# Altium schematic sheet RFMC_ADC.SchDoc: RFSoC AMC
size 420 x 297 mm; CompanyName: WUT; DrawnBy: T. Przywozki; Organization: WUT ISE; Address1: Warsaw University of Technology; Address2: Nowowiejska 15/19 00-665 Warsaw; Address3: Tomasz.Przywozki@pw.edu.pl; DocumentNumber: 18; Revision: 1; SheetNumber: 18; SheetTotal: 45; Project: RFSoC AMC; ModifiedBy: T. Przywozki; CreateDate: -; CheckedDate: -; DivGrp: ISE; Designer: T. Przywozki; ModifiedDate: -; ProjectName: ADC/DAC MEZZANINE
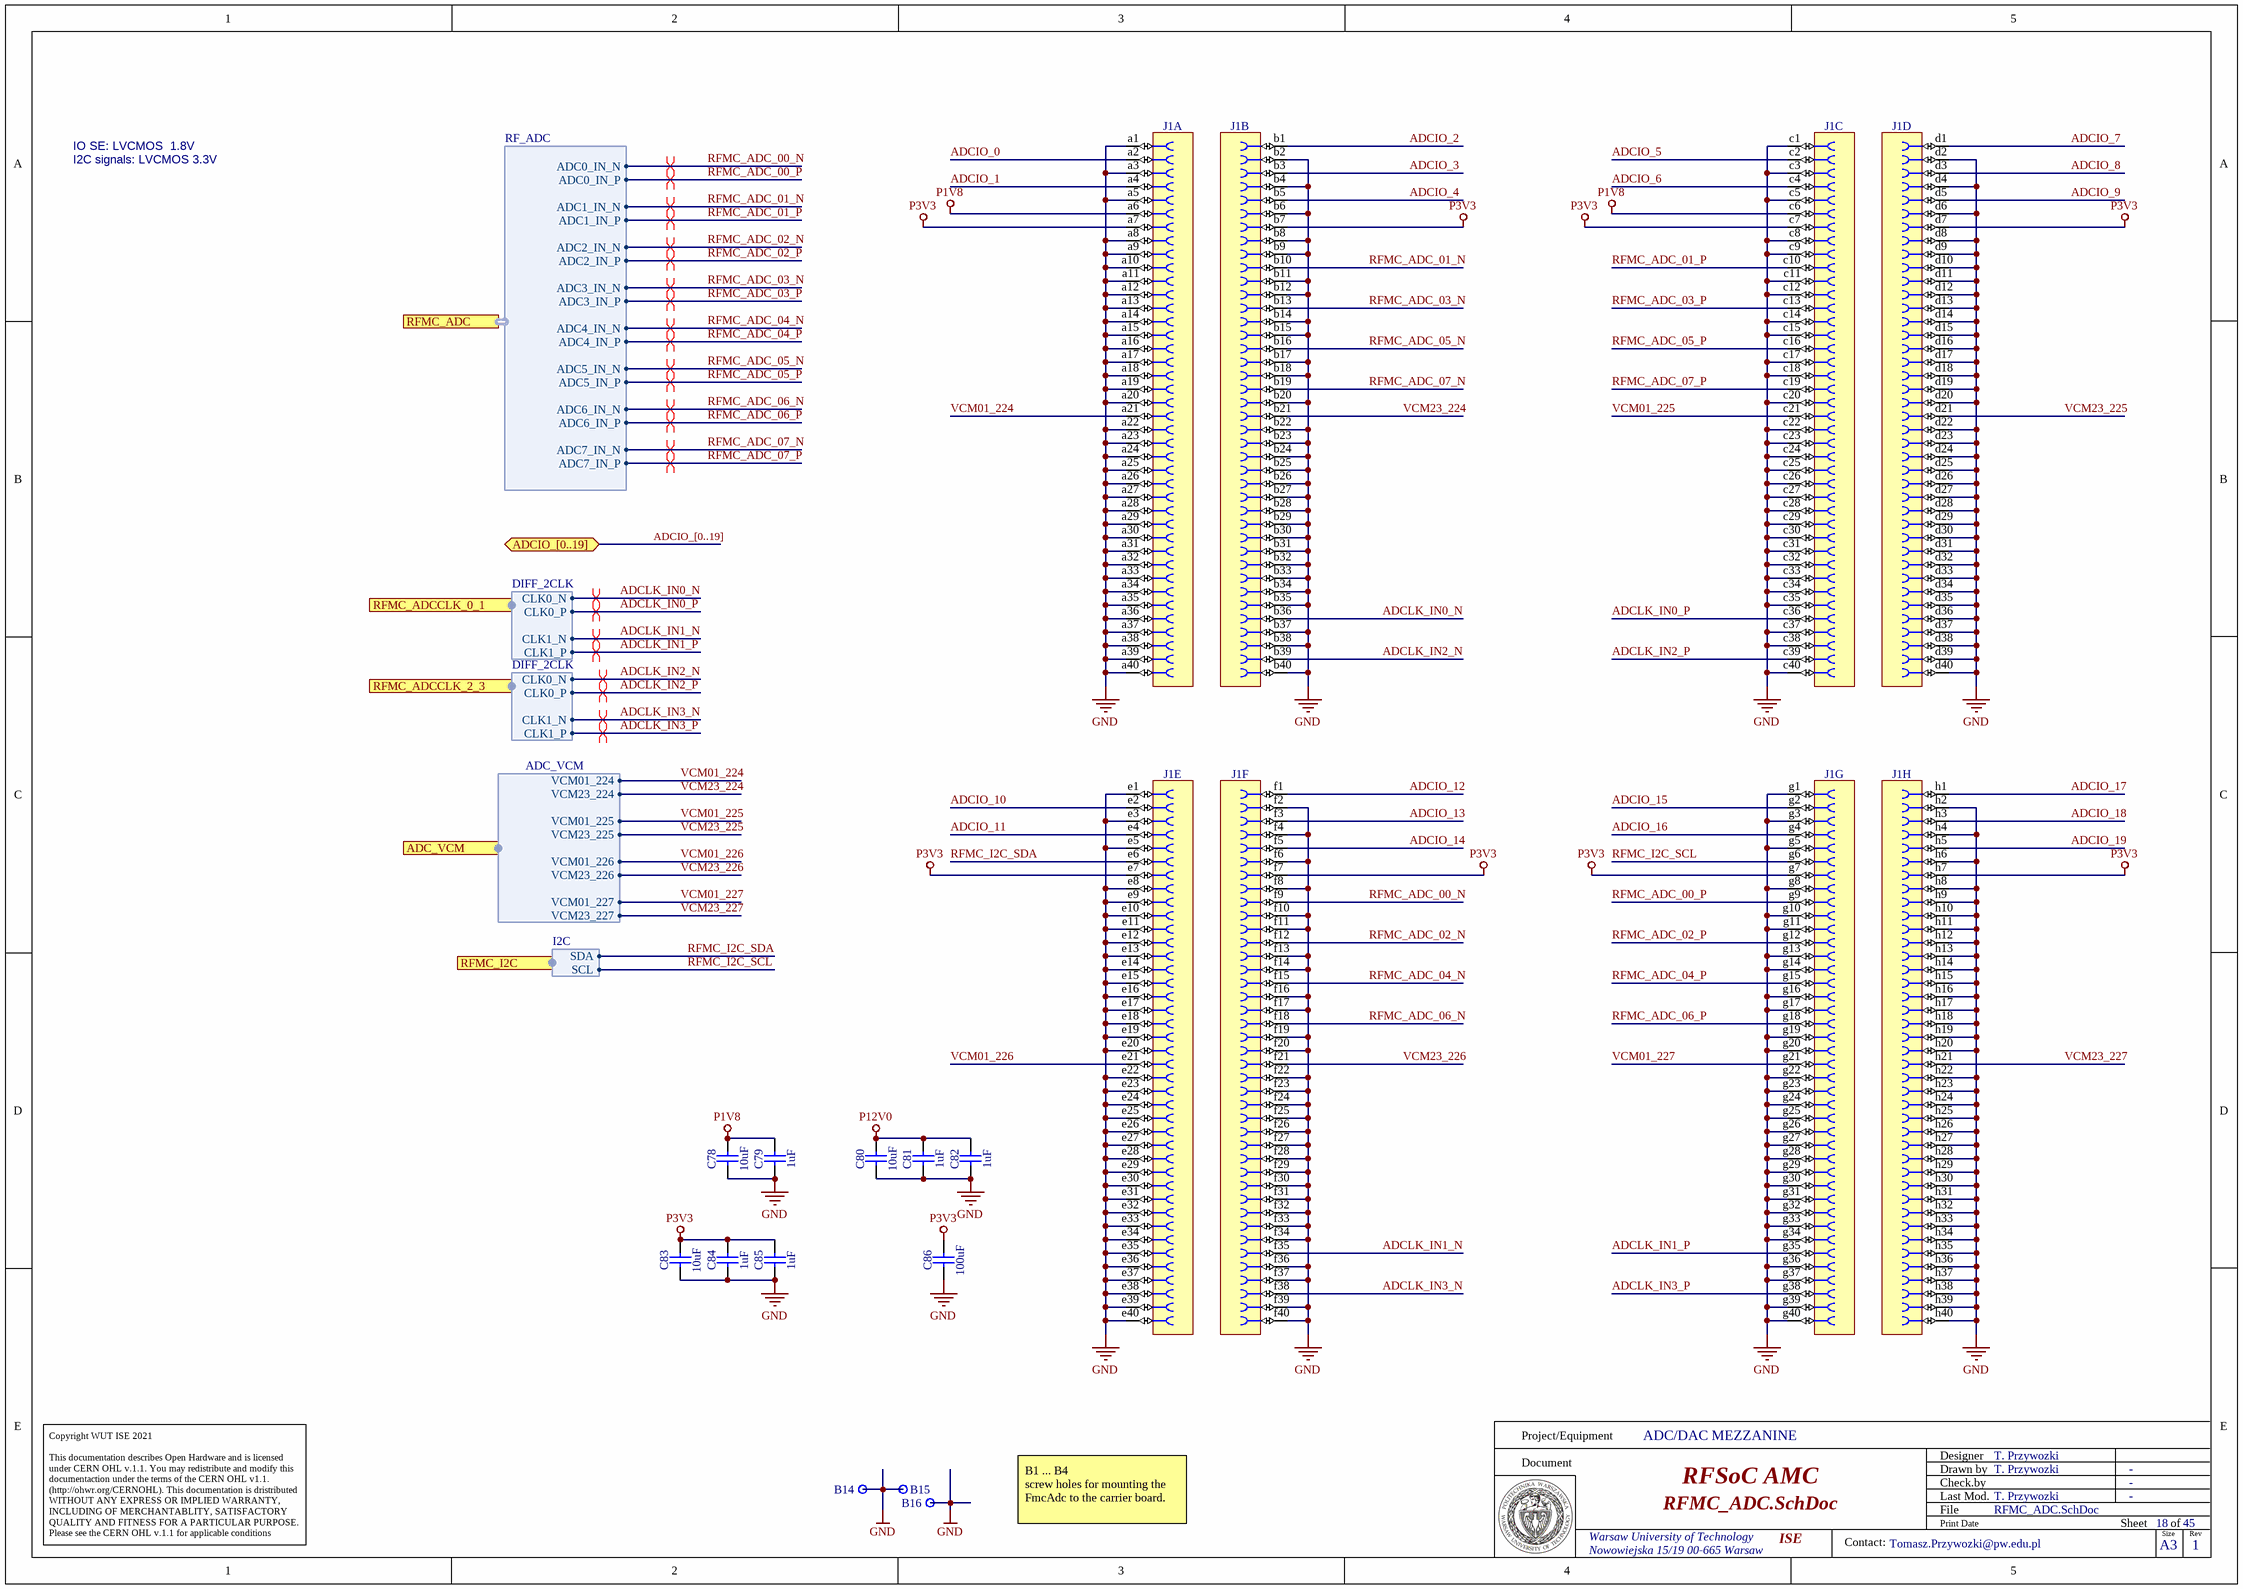
[diagram p0: RFMC_ADC.SchDoc]

## Parts
B14  Plated Hole  [MTG270_500]  (value not drawn)
B15  Plated Hole  [MTG270_500]  (value not drawn)
B16  Plated Hole  [MTG270_500]  (value not drawn)
C78  10uF  [CAPC1608X80N]
C79  1uF  [CAPC1005X55N]
C80  10uF  [CAPC1608X80N]
C81  1uF  [CAPC1005X55N]
C82  1uF  [CAPC1005X55N]
C83  10uF  [CAPC1608X80N]
C84  1uF  [CAPC1005X55N]
C85  1uF  [CAPC1005X55N]
C86  100uF  [CAPC3216X180N]
J1  (no value)  [SAMTEC_LPAF-40-03.0-S-08]  (parts A,B,C,D,E,F,G,H of 8)

## Ports
ADC_VCM (harness ADC_VCM), ADCIO_[0..19] (bidir), RFMC_ADC (harness RF_ADC), RFMC_ADCCLK_0_1 (harness DIFF_2CLK), RFMC_ADCCLK_2_3 (harness DIFF_2CLK), RFMC_I2C (harness I2C)

## Harnesses
RF_ADC: ADC0_IN_N, ADC0_IN_P, ADC1_IN_N, ADC1_IN_P, ADC2_IN_N, ADC2_IN_P, ADC3_IN_N, ADC3_IN_P, ADC4_IN_N, ADC4_IN_P, ADC5_IN_N, ADC5_IN_P, ADC6_IN_N, ADC6_IN_P, ADC7_IN_N, ADC7_IN_P
ADC_VCM: VCM01_224, VCM23_224, VCM23_225, VCM01_226, VCM01_227, VCM23_227, VCM01_225, VCM23_226
DIFF_2CLK: CLK0_P, CLK0_N, CLK1_P, CLK1_N
I2C: SCL, SDA

## Nets
GND: B14.1 B15.1 B16.1 C78.1 C79.2 C80.1 C81.2 C82.2 C83.1 C84.2 C85.2 C86.1 J1.a1 J1.a3 J1.a5 J1.a8 J1.a9 J1.a10 J1.a11 J1.a12 J1.a13 J1.a14 J1.a15 J1.a16 J1.a17 J1.a18 J1.a19 J1.a20 J1.a22 J1.a23 J1.a24 J1.a25 J1.a26 J1.a27 J1.a28 J1.a29 J1.a30 J1.a31 J1.a32 J1.a33 J1.a34 J1.a35 J1.a36 J1.a37 J1.a38 J1.a39 J1.a40 J1.b2 J1.b4 J1.b6 J1.b8 J1.b9 J1.b11 J1.b12 J1.b14 J1.b15 J1.b17 J1.b18 J1.b20 J1.b22 J1.b23 J1.b24 J1.b25 J1.b26 J1.b27 J1.b28 J1.b29 J1.b30 J1.b31 J1.b32 J1.b33 J1.b34 J1.b35 J1.b37 J1.b38 J1.b40 J1.c1 J1.c3 J1.c5 J1.c8 J1.c9 J1.c11 J1.c12 J1.c14 J1.c15 J1.c17 J1.c18 J1.c20 J1.c22 J1.c23 J1.c24 J1.c25 J1.c26 J1.c27 J1.c28 J1.c29 J1.c30 J1.c31 J1.c32 J1.c33 J1.c34 J1.c35 J1.c37 J1.c38 J1.c40 J1.d2 J1.d4 J1.d6 J1.d8 J1.d9 J1.d10 J1.d11 J1.d12 J1.d13 J1.d14 J1.d15 J1.d16 J1.d17 J1.d18 J1.d19 J1.d20 J1.d22 J1.d23 J1.d24 J1.d25 J1.d26 J1.d27 J1.d28 J1.d29 J1.d30 J1.d31 J1.d32 J1.d33 J1.d34 J1.d35 J1.d36 J1.d37 J1.d38 J1.d39 J1.d40 J1.e1 J1.e3 J1.e5 J1.e8 J1.e9 J1.e10 J1.e11 J1.e12 J1.e13 J1.e14 J1.e15 J1.e16 J1.e17 J1.e18 J1.e19 J1.e20 J1.e22 J1.e23 J1.e24 J1.e25 J1.e26 J1.e27 J1.e28 J1.e29 J1.e30 J1.e31 J1.e32 J1.e33 J1.e34 J1.e35 J1.e36 J1.e37 J1.e38 J1.e39 J1.e40 J1.f2 J1.f4 J1.f6 J1.f8 J1.f10 J1.f11 J1.f13 J1.f14 J1.f16 J1.f17 J1.f19 J1.f20 J1.f22 J1.f23 J1.f24 J1.f25 J1.f26 J1.f27 J1.f28 J1.f29 J1.f30 J1.f31 J1.f32 J1.f33 J1.f34 J1.f36 J1.f37 J1.f39 J1.f40 J1.g1 J1.g3 J1.g5 J1.g8 J1.g10 J1.g11 J1.g13 J1.g14 J1.g16 J1.g17 J1.g19 J1.g20 J1.g22 J1.g23 J1.g24 J1.g25 J1.g26 J1.g27 J1.g28 J1.g29 J1.g30 J1.g31 J1.g32 J1.g33 J1.g34 J1.g36 J1.g37 J1.g39 J1.g40 J1.h2 J1.h4 J1.h6 J1.h8 J1.h9 J1.h10 J1.h11 J1.h12 J1.h13 J1.h14 J1.h15 J1.h16 J1.h17 J1.h18 J1.h19 J1.h20 J1.h22 J1.h23 J1.h24 J1.h25 J1.h26 J1.h27 J1.h28 J1.h29 J1.h30 J1.h31 J1.h32 J1.h33 J1.h34 J1.h35 J1.h36 J1.h37 J1.h38 J1.h39 J1.h40
P1V8: C78.2 C79.1 J1.a6 J1.c6
P3V3: C83.2 C84.1 C85.1 C86.2 J1.a7 J1.b7 J1.c7 J1.d7 J1.e7 J1.f7 J1.g7 J1.h7
P12V0: C80.2 C81.1 C82.1
ADCIO_0: J1.a2
ADCIO_1: J1.a4
ADCIO_2: J1.b1
ADCIO_3: J1.b3
ADCIO_4: J1.b5
ADCIO_5: J1.c2
ADCIO_6: J1.c4
ADCIO_7: J1.d1
ADCIO_8: J1.d3
ADCIO_9: J1.d5
ADCIO_10: J1.e2
ADCIO_11: J1.e4
ADCIO_12: J1.f1
ADCIO_13: J1.f3
ADCIO_14: J1.f5
ADCIO_15: J1.g2
ADCIO_16: J1.g4
ADCIO_17: J1.h1
ADCIO_18: J1.h3
ADCIO_19: J1.h5
ADCLK_IN0_N: J1.b36 ; port RFMC_ADCCLK_0_1.CLK0_N
ADCLK_IN0_P: J1.c36 ; port RFMC_ADCCLK_0_1.CLK0_P
ADCLK_IN1_N: J1.f35 ; port RFMC_ADCCLK_0_1.CLK1_N
ADCLK_IN1_P: J1.g35 ; port RFMC_ADCCLK_0_1.CLK1_P
ADCLK_IN2_N: J1.b39 ; port RFMC_ADCCLK_2_3.CLK0_N
ADCLK_IN2_P: J1.c39 ; port RFMC_ADCCLK_2_3.CLK0_P
ADCLK_IN3_N: J1.f38 ; port RFMC_ADCCLK_2_3.CLK1_N
ADCLK_IN3_P: J1.g38 ; port RFMC_ADCCLK_2_3.CLK1_P
RFMC_ADC_00_N: J1.f9 ; port RFMC_ADC.ADC0_IN_N
RFMC_ADC_00_P: J1.g9 ; port RFMC_ADC.ADC0_IN_P
RFMC_ADC_01_N: J1.b10 ; port RFMC_ADC.ADC1_IN_N
RFMC_ADC_01_P: J1.c10 ; port RFMC_ADC.ADC1_IN_P
RFMC_ADC_02_N: J1.f12 ; port RFMC_ADC.ADC2_IN_N
RFMC_ADC_02_P: J1.g12 ; port RFMC_ADC.ADC2_IN_P
RFMC_ADC_03_N: J1.b13 ; port RFMC_ADC.ADC3_IN_N
RFMC_ADC_03_P: J1.c13 ; port RFMC_ADC.ADC3_IN_P
RFMC_ADC_04_N: J1.f15 ; port RFMC_ADC.ADC4_IN_N
RFMC_ADC_04_P: J1.g15 ; port RFMC_ADC.ADC4_IN_P
RFMC_ADC_05_N: J1.b16 ; port RFMC_ADC.ADC5_IN_N
RFMC_ADC_05_P: J1.c16 ; port RFMC_ADC.ADC5_IN_P
RFMC_ADC_06_N: J1.f18 ; port RFMC_ADC.ADC6_IN_N
RFMC_ADC_06_P: J1.g18 ; port RFMC_ADC.ADC6_IN_P
RFMC_ADC_07_N: J1.b19 ; port RFMC_ADC.ADC7_IN_N
RFMC_ADC_07_P: J1.c19 ; port RFMC_ADC.ADC7_IN_P
RFMC_I2C_SCL: J1.g6 ; port RFMC_I2C.SCL
RFMC_I2C_SDA: J1.e6 ; port RFMC_I2C.SDA
VCM01_224: J1.a21 ; port ADC_VCM.VCM01_224
VCM01_225: J1.c21 ; port ADC_VCM.VCM01_225
VCM01_226: J1.e21 ; port ADC_VCM.VCM01_226
VCM01_227: J1.g21 ; port ADC_VCM.VCM01_227
VCM23_224: J1.b21 ; port ADC_VCM.VCM23_224
VCM23_225: J1.d21 ; port ADC_VCM.VCM23_225
VCM23_226: J1.f21 ; port ADC_VCM.VCM23_226
VCM23_227: J1.h21 ; port ADC_VCM.VCM23_227

## Buses and harness runs
bus ADCIO_[0..19] = port ADCIO_[0..19]

## Layout directives
differential pair: ADCLK_IN0_N, ADCLK_IN0_P, ADCLK_IN1_N, ADCLK_IN1_P, ADCLK_IN2_N, ADCLK_IN2_P, ADCLK_IN3_N, ADCLK_IN3_P, RFMC_ADC_00_N, RFMC_ADC_00_P, RFMC_ADC_01_N, RFMC_ADC_01_P, RFMC_ADC_02_N, RFMC_ADC_02_P, RFMC_ADC_03_N, RFMC_ADC_03_P, RFMC_ADC_04_N, RFMC_ADC_04_P, RFMC_ADC_05_N, RFMC_ADC_05_P, RFMC_ADC_06_N, RFMC_ADC_06_P, RFMC_ADC_07_N, RFMC_ADC_07_P

## Notes on the sheet
- I2C signals: LVCMOS 3.3V
- IO SE: LVCMOS  1.8V
- B1 ... B4
  screw holes for mounting the FmcAdc to the carrier board.
- Project/Equipment
- Document
- Designer
- Drawn by
- Check.by
- Copyright WUT ISE 2021
  This documentation describes Open Hardware and is licensed under CERN OHL v.1.1. You may redistribute and modify this documentaction under the terms of the CERN OHL v1.1.
  (http://ohwr.org/CERNOHL). This documentation is dristributed WITHOUT ANY EXPRESS OR IMPLIED WARRANTY, INCLUDING OF MERCHANTABLITY, SATISFACTORY QUALITY AND FITNESS FOR A PARTICULAR PURPOSE. Please see the CERN OHL v.1.1 for applicable conditions
- File
- Last Mod.
- Print Date
- Sheet
- Size
- A3
- of
- Rev
- Contact:

## Library data of the parts
B14-B16 = PLATED_HOLE2.7_PAD5.0: Single Terminal Socket; Part Description: Plated Through Hole: Hole Dia.=2.7mm Pad Dia.=5.0mm; Mounted: No; Part Number: PLATED_HOLE2.7_PAD5.0; Component Kind: Standard (No BOM); Component Type: Standard (No BOM); Pin Count: 1; Family: Plated Hole; Socket: No; SMD: No; Sense: No; Status: None; ComponentHeight: 0mm; HelpURL: Undefined; Author: CERN DEM JMW; CreateDate: 27.09.2011; LatestRevisionDate: 27.09.2011; PackageDescription: Plated Through Hole: Hole Dia.=2.7mm Pad Dia.=5.0mm
C78 C80 C83 = CC0603_10UF_10V_10%_X5R: Non-polarised capacitor; Part Description: SMD Multilayer Chip Ceramic Capacitor; Manufacturer: GENERIC; Manufacturer1 Part Number: GRM188R61A106KE69D; Voltage: 10V; TC: X5R; Tolerance: ±10%; Part Number: CC0603_10UF_10V_10%_X5R; Component Kind: Standard; Component Type: Standard; Pin Count: 2; Value: 10uF; Status: None; Manufacturer Part Number: CC0603_10UF_10V_10%_X5R; Case: 0603; Mounted: Yes; Socket: No; SMD: Yes; Sense: No; Manufacturer1 Example: MURATA; Manufacturer1 ComponentHeight: 0.8mm; HelpURL: \\cern.ch\dfs\Applications\Altium\Datasheets\CC0603_MURATA_GRM188R61A106KE69D.pdf; Author: CERN DEM JLC; CreateDate: 31.01.2017; LatestRevisionDate: 31.01.2017
C79 C81 C82 C84 C85 = CC0402_1UF_16V_10%_X5R: Non-polarised capacitor; Part Description: SMD Multilayer Chip Ceramic Capacitor; Manufacturer: GENERIC; Manufacturer1 Part Number: C1005X5R1C105KT; Voltage: 16V; TC: X5R; Tolerance: ±10%; Part Number: CC0402_1UF_16V_10%_X5R; Component Kind: Standard; Component Type: Standard; Pin Count: 2; Value: 1uF; Status: Preferred; Manufacturer Part Number: CC0402_1UF_16V_10%_X5R; Case: 0402; Mounted: Yes; Socket: No; SMD: Yes; Sense: No; Manufacturer1 Example: TDK; Manufacturer1 ComponentHeight: 0.55mm; HelpURL: \\cern.ch\dfs\Applications\Altium\Datasheets\CC0402_X5R_TDK_C.pdf; Author: CERN DEM JLC; CreateDate: 25.10.2012; LatestRevisionDate: 25.10.2012
C86 = CC1206_100UF_6.3V_20%_X5R: Non-polarised capacitor; Part Description: SMD Multilayer Chip Ceramic Capacitor; Manufacturer: GENERIC; Manufacturer1 Part Number: C1206C107M9PACTU; Voltage: 6.3V; Tolerance: ±10%; TC: X5R; Part Number: CC1206_100UF_6.3V_20%_X5R; Component Kind: Standard; Component Type: Standard; Pin Count: 2; Value: 100uF; Status: None; Manufacturer Part Number: CC1206_100UF_6.3V_20%_X5R; Case: 1206; Mounted: Yes; Socket: No; SMD: Yes; Sense: No; Manufacturer1 Example: KEMET; Manufacturer1 ComponentHeight: 1.8mm; HelpURL: \\cern.ch\dfs\Applications\Altium\Datasheets\CC1206_X5R_KEMET.pdf; Author: CERN DEM JLC; CreateDate: 26.09.2012; LatestRevisionDate: 26.09.2012
J1 = SAMTEC_LPAF-40-03.0-S-08-2-K: Connector 320 Female contacts in 8 row abcdef; Part Description: 320 Contacts (8x40), Pitch 1.27mm, Straight High Speed Low-Profile Open-Pin-Field Socket; Manufacturer: SAMTEC; PressFit: No; Sense Comment: Solder Paste Deposition Sensitive – Check Manufacturer Recommendations for Stencil Design; Part Number: SAMTEC_LPAF-40-03.0-S-08-2-K; Component Kind: Standard; Component Type: Standard; Pin Count: 320; Mounted: Yes; Socket: No; SMD: Yes; Sense: Yes; Status: None; Manufacturer Part Number: LPAF-40-03.0-S-08-2-K; ComponentHeight: 2.79mm; HelpURL: \\cern.ch\dfs\Applications\Altium\Datasheets\SAMTEC_LPAF-40-03.0-S-08-2-K.pdf; Author: CERN DEM BC; CreateDate: 02.12.2020; LatestRevisionDate: 02.12.2020